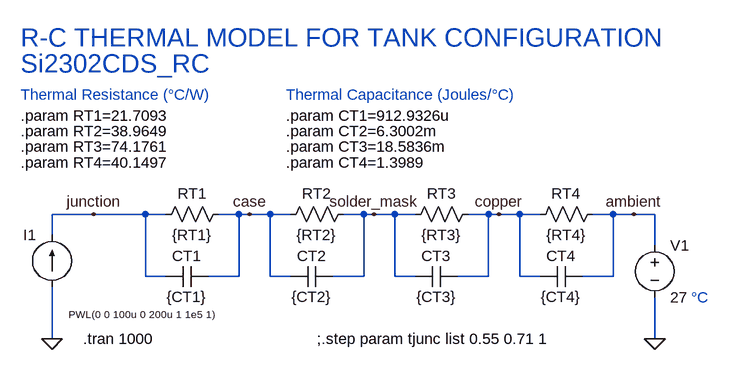
[diagram p0: schematic 01-Si2302CDS_RC_thermal_tank.asc]
01-Si2302CDS_RC_thermal_tank.asc, the LTspice schematic file:
Version 4
SHEET 1 1136 680
WIRE 128 160 64 160
WIRE 208 160 128 160
WIRE 240 160 208 160
WIRE 352 160 320 160
WIRE 368 160 352 160
WIRE 400 160 368 160
WIRE 432 160 400 160
WIRE 544 160 512 160
WIRE 560 160 544 160
WIRE 592 160 560 160
WIRE 624 160 592 160
WIRE 736 160 704 160
WIRE 752 160 736 160
WIRE 784 160 752 160
WIRE 816 160 784 160
WIRE 928 160 896 160
WIRE 960 160 928 160
WIRE 992 160 960 160
WIRE 64 192 64 160
WIRE 992 208 992 160
WIRE 208 256 208 160
WIRE 240 256 208 256
WIRE 352 256 352 160
WIRE 352 256 304 256
WIRE 400 256 400 160
WIRE 432 256 400 256
WIRE 544 256 544 160
WIRE 544 256 496 256
WIRE 592 256 592 160
WIRE 624 256 592 256
WIRE 736 256 736 160
WIRE 736 256 688 256
WIRE 784 256 784 160
WIRE 816 256 784 256
WIRE 928 256 928 160
WIRE 928 256 880 256
WIRE 64 352 64 272
WIRE 992 352 992 288
FLAG 64 352 0
FLAG 128 160 junction
FLAG 992 352 0
FLAG 960 160 ambient
FLAG 368 160 case
FLAG 560 160 solder_mask
FLAG 752 160 copper
SYMBOL current 64 272 R180
WINDOW 0 24 80 Left 2
WINDOW 3 -247 -42 Left 1
WINDOW 123 0 0 Left 0
WINDOW 39 0 0 Left 0
SYMATTR InstName I1
SYMATTR Value PWL(0 0 100u 0 200u 1 1e5 1)
SYMBOL res 336 144 R90
WINDOW 0 0 56 VBottom 2
WINDOW 3 32 56 VTop 2
SYMATTR InstName RT1
SYMATTR Value {RT1}
SYMBOL cap 304 240 R90
WINDOW 0 0 32 VBottom 2
WINDOW 3 32 32 VTop 2
SYMATTR InstName CT1
SYMATTR Value {CT1}
SYMBOL res 528 144 R90
WINDOW 0 0 56 VBottom 2
WINDOW 3 32 56 VTop 2
SYMATTR InstName RT2
SYMATTR Value {RT2}
SYMBOL cap 496 240 R90
WINDOW 0 0 32 VBottom 2
WINDOW 3 32 32 VTop 2
SYMATTR InstName CT2
SYMATTR Value {CT2}
SYMBOL voltage 992 192 R0
WINDOW 123 0 0 Left 0
WINDOW 39 0 0 Left 0
SYMATTR InstName V1
SYMATTR Value 27
SYMBOL res 720 144 R90
WINDOW 0 0 56 VBottom 2
WINDOW 3 32 56 VTop 2
SYMATTR InstName RT3
SYMATTR Value {RT3}
SYMBOL cap 688 240 R90
WINDOW 0 0 32 VBottom 2
WINDOW 3 32 32 VTop 2
SYMATTR InstName CT3
SYMATTR Value {CT3}
SYMBOL res 912 144 R90
WINDOW 0 0 56 VBottom 2
WINDOW 3 32 56 VTop 2
SYMATTR InstName RT4
SYMATTR Value {RT4}
SYMBOL cap 880 240 R90
WINDOW 0 0 32 VBottom 2
WINDOW 3 32 32 VTop 2
SYMATTR InstName CT4
SYMATTR Value {CT4}
TEXT 16 8 Left 2 !.param RT1=21.7093
TEXT 16 -24 Left 2 ;Thermal Resistance (°C/W)
TEXT 424 8 Left 2 !.param CT1=912.9326u
TEXT 424 -24 Left 2 ;Thermal Capacitance (Joules/°C)
TEXT 112 352 Left 2 !.tran 1000
TEXT 16 32 Left 2 !.param RT2=38.9649
TEXT 424 32 Left 2 !.param CT2=6.3002m
TEXT 16 56 Left 2 !.param RT3=74.1761
TEXT 424 56 Left 2 !.param CT3=18.5836m
TEXT 16 80 Left 2 !.param RT4=40.1497
TEXT 424 80 Left 2 !.param CT4=1.3989
TEXT 16 -112 Left 4 ;R-C THERMAL MODEL FOR TANK CONFIGURATION
TEXT 16 -72 Left 4 ;Si2302CDS_RC
TEXT 1048 288 Left 2 ;°C
TEXT 472 352 Left 2 !;.step param tjunc list 0.55 0.71 1

The netlist it stands for:
* 01-Si2302CDS_RC_thermal_tank.asc
I1 0 junction PWL(0 0 100u 0 200u 1 1e5 1)
RT1 case junction {RT1}
CT1 case junction {CT1}
RT2 solder_mask case {RT2}
CT2 solder_mask case {CT2}
V1 ambient 0 27
RT3 copper solder_mask {RT3}
CT3 copper solder_mask {CT3}
RT4 ambient copper {RT4}
CT4 ambient copper {CT4}
.param RT1=21.7093
* Thermal Resistance (°C/W)
.param CT1=912.9326u
* Thermal Capacitance (Joules/°C)
.tran 1000
.param RT2=38.9649
.param CT2=6.3002m
.param RT3=74.1761
.param CT3=18.5836m
.param RT4=40.1497
.param CT4=1.3989
* R-C THERMAL MODEL FOR TANK CONFIGURATION
* Si2302CDS_RC
* °C
;.step param tjunc list 0.55 0.71 1
.backanno
.end